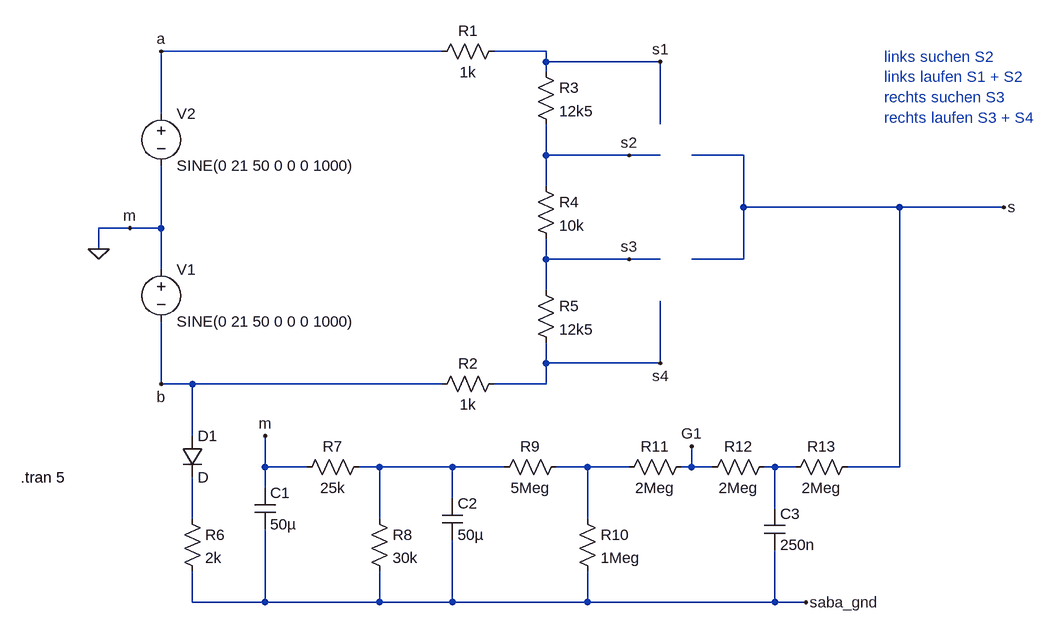
[diagram p0: schematic suchlauf_schalter.asc]
suchlauf_schalter.asc, the LTspice schematic file:
Version 4
SHEET 1 1956 796
WIRE 496 -112 64 -112
WIRE 656 -112 576 -112
WIRE 656 -96 656 -112
WIRE 832 -96 656 -96
WIRE 656 -80 656 -96
WIRE 64 -16 64 -112
WIRE 832 0 832 -96
WIRE 656 48 656 0
WIRE 784 48 656 48
WIRE 832 48 784 48
WIRE 960 48 880 48
WIRE 656 96 656 48
WIRE 960 128 960 48
WIRE 1200 128 960 128
WIRE 1360 128 1200 128
WIRE 16 160 -32 160
WIRE 64 160 64 64
WIRE 64 160 16 160
WIRE -32 192 -32 160
WIRE 656 208 656 176
WIRE 784 208 656 208
WIRE 832 208 784 208
WIRE 960 208 960 128
WIRE 960 208 880 208
WIRE 64 224 64 160
WIRE 656 256 656 208
WIRE 656 368 656 336
WIRE 832 368 832 272
WIRE 832 368 656 368
WIRE 64 400 64 304
WIRE 112 400 64 400
WIRE 496 400 112 400
WIRE 656 400 656 368
WIRE 656 400 576 400
WIRE 112 480 112 400
WIRE 224 528 224 480
WIRE 288 528 224 528
WIRE 400 528 368 528
WIRE 512 528 400 528
WIRE 592 528 512 528
WIRE 720 528 672 528
WIRE 784 528 720 528
WIRE 880 528 880 496
WIRE 880 528 864 528
WIRE 912 528 880 528
WIRE 1008 528 992 528
WIRE 1040 528 1008 528
WIRE 1200 528 1200 128
WIRE 1200 528 1120 528
WIRE 224 560 224 528
WIRE 512 576 512 528
WIRE 1008 592 1008 528
WIRE 112 608 112 544
WIRE 400 608 400 528
WIRE 720 608 720 528
WIRE 112 736 112 688
WIRE 224 736 224 624
WIRE 224 736 112 736
WIRE 400 736 400 688
WIRE 400 736 224 736
WIRE 512 736 512 640
WIRE 512 736 400 736
WIRE 720 736 720 688
WIRE 720 736 512 736
WIRE 1008 736 1008 656
WIRE 1008 736 720 736
WIRE 1056 736 1008 736
FLAG -32 192 0
FLAG 16 160 m
FLAG 64 -112 a
FLAG 64 400 b
FLAG 1360 128 s
FLAG 224 480 m
FLAG 832 -96 s1
FLAG 784 48 s2
FLAG 784 208 s3
FLAG 832 368 s4
FLAG 880 496 G1
FLAG 1056 736 saba_gnd
SYMBOL voltage 64 208 R0
WINDOW 123 0 0 Left 0
WINDOW 39 0 0 Left 0
SYMATTR InstName V1
SYMATTR Value SINE(0 21 50 0 0 0 1000)
SYMBOL voltage 64 -32 R0
WINDOW 123 0 0 Left 0
WINDOW 39 0 0 Left 0
SYMATTR InstName V2
SYMATTR Value SINE(0 21 50 0 0 0 1000)
SYMBOL res 592 -128 R90
WINDOW 0 0 56 VBottom 2
WINDOW 3 32 56 VTop 2
SYMATTR InstName R1
SYMATTR Value 1k
SYMBOL res 592 384 R90
WINDOW 0 0 56 VBottom 2
WINDOW 3 32 56 VTop 2
SYMATTR InstName R2
SYMATTR Value 1k
SYMBOL res 640 -96 R0
SYMATTR InstName R3
SYMATTR Value 12k5
SYMBOL res 640 80 R0
SYMATTR InstName R4
SYMATTR Value 10k
SYMBOL res 640 240 R0
SYMATTR InstName R5
SYMATTR Value 12k5
SYMBOL diode 96 480 R0
SYMATTR InstName D1
SYMBOL res 96 592 R0
SYMATTR InstName R6
SYMATTR Value 2k
SYMBOL cap 208 560 R0
SYMATTR InstName C1
SYMATTR Value 50µ
SYMBOL res 384 512 R90
WINDOW 0 0 56 VBottom 2
WINDOW 3 32 56 VTop 2
SYMATTR InstName R7
SYMATTR Value 25k
SYMBOL res 384 592 R0
SYMATTR InstName R8
SYMATTR Value 30k
SYMBOL res 688 512 R90
WINDOW 0 0 56 VBottom 2
WINDOW 3 32 56 VTop 2
SYMATTR InstName R9
SYMATTR Value 5Meg
SYMBOL res 704 592 R0
SYMATTR InstName R10
SYMATTR Value 1Meg
SYMBOL res 880 512 R90
WINDOW 0 0 56 VBottom 2
WINDOW 3 32 56 VTop 2
SYMATTR InstName R11
SYMATTR Value 2Meg
SYMBOL cap 496 576 R0
SYMATTR InstName C2
SYMATTR Value 50µ
SYMBOL res 1008 512 R90
WINDOW 0 0 56 VBottom 2
WINDOW 3 32 56 VTop 2
SYMATTR InstName R12
SYMATTR Value 2Meg
SYMBOL res 1136 512 R90
WINDOW 0 0 56 VBottom 2
WINDOW 3 32 56 VTop 2
SYMATTR InstName R13
SYMATTR Value 2Meg
SYMBOL cap 992 592 R0
SYMATTR InstName C3
SYMATTR Value 250n
TEXT -152 544 Left 2 !.tran 5
TEXT 1176 -104 Left 2 ;links suchen S2\nlinks laufen S1 + S2\nrechts suchen S3\nrechts laufen S3 + S4

The netlist it stands for:
* suchlauf_schalter.asc
V1 0 b SINE(0 21 50 0 0 0 1000)
V2 a 0 SINE(0 21 50 0 0 0 1000)
R1 s1 a 1k
R2 s4 b 1k
R3 s1 s2 12k5
R4 s2 s3 10k
R5 s3 s4 12k5
D1 b N004 D
R6 N004 saba_gnd 2k
C1 0 saba_gnd 50µ
R7 N001 0 25k
R8 N001 saba_gnd 30k
R9 N002 N001 5Meg
R10 N002 saba_gnd 1Meg
R11 G1 N002 2Meg
C2 N001 saba_gnd 50µ
R12 N003 G1 2Meg
R13 s N003 2Meg
C3 N003 saba_gnd 250n
.model D D
.lib standard.dio
.tran 5
* links suchen S2
* links laufen S1 + S2
* rechts suchen S3
* rechts laufen S3 + S4
.backanno
.end